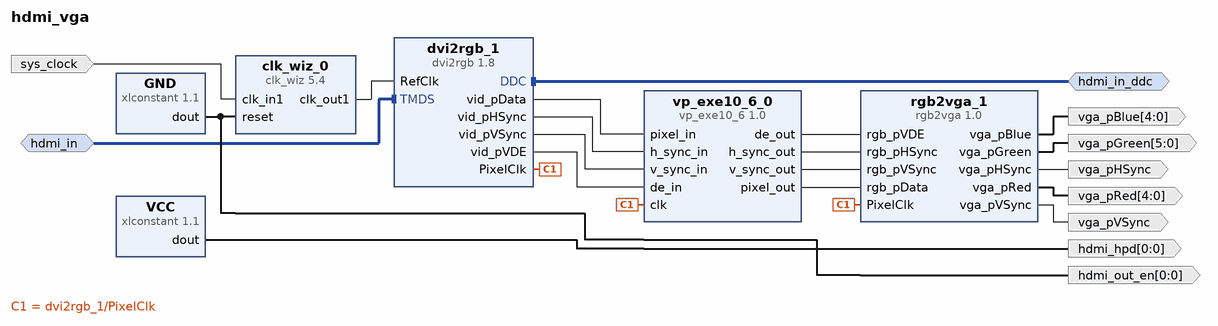
[diagram p0: block diagram of the top level]
# Vivado block design hdmi_vga, xc7z010clg400-1, Vivado 2017.4
create_bd_design hdmi_vga

create_bd_intf_port -mode Master -vlnv xilinx.com:interface:iic_rtl:1.0 hdmi_in_ddc
create_bd_intf_port -mode Slave -vlnv digilentinc.com:interface:tmds_rtl:1.0 hdmi_in
create_bd_port -dir O -from 0 -to 0 hdmi_out_en
create_bd_port -dir O -from 0 -to 0 hdmi_hpd
create_bd_port -dir I -type clk sys_clock
set_property -dict {CONFIG.FREQ_HZ 125000000 CONFIG.CLK_DOMAIN hdmi_vga_sys_clk} [get_bd_ports sys_clock]
create_bd_port -dir O -from 4 -to 0 vga_pRed
create_bd_port -dir O -from 5 -to 0 vga_pGreen
create_bd_port -dir O -from 4 -to 0 vga_pBlue
create_bd_port -dir O vga_pHSync
create_bd_port -dir O vga_pVSync

create_bd_cell -type ip -vlnv xilinx.com:ip:clk_wiz:5.4 clk_wiz_0
set_property -dict [list \
  CONFIG.PRIMITIVE PLL \
  CONFIG.CLKOUT1_REQUESTED_OUT_FREQ 200.000 \
  CONFIG.CLKOUT1_DRIVES BUFG \
  CONFIG.CLKOUT2_DRIVES BUFG \
  CONFIG.CLKOUT3_DRIVES BUFG \
  CONFIG.CLKOUT4_DRIVES BUFG \
  CONFIG.CLKOUT5_DRIVES BUFG \
  CONFIG.CLKOUT6_DRIVES BUFG \
  CONFIG.CLKOUT7_DRIVES BUFG \
  CONFIG.MMCM_DIVCLK_DIVIDE 1 \
  CONFIG.MMCM_CLKFBOUT_MULT_F 8 \
  CONFIG.MMCM_COMPENSATION ZHOLD \
  CONFIG.MMCM_CLKOUT0_DIVIDE_F 5 \
  CONFIG.CLKOUT1_JITTER 109.241 \
  CONFIG.CLKOUT1_PHASE_ERROR 96.948 \
] [get_bd_cells clk_wiz_0]
create_bd_cell -type ip -vlnv xilinx.com:ip:xlconstant:1.1 GND
set_property -dict {CONFIG.CONST_VAL 0} [get_bd_cells GND]
create_bd_cell -type ip -vlnv xilinx.com:ip:xlconstant:1.1 VCC
create_bd_cell -type ip -vlnv digilentinc.com:ip:rgb2vga:1.0 rgb2vga_1
create_bd_cell -type ip -vlnv digilentinc.com:ip:dvi2rgb:1.8 dvi2rgb_1
create_bd_cell -type ip -vlnv xilinx.com:user:vp_exe10_6:1.0 vp_exe10_6_0

# ---- connections ----

connect_bd_intf_net [get_bd_intf_ports hdmi_in_ddc] [get_bd_intf_pins dvi2rgb_1/DDC]
connect_bd_intf_net [get_bd_intf_ports hdmi_in] [get_bd_intf_pins dvi2rgb_1/TMDS]
connect_bd_net [get_bd_pins GND/dout] [get_bd_ports hdmi_out_en] [get_bd_pins clk_wiz_0/reset]
connect_bd_net -net dvi2rgb_0_PixelClk [get_bd_pins dvi2rgb_1/PixelClk] [get_bd_pins rgb2vga_1/PixelClk] [get_bd_pins vp_exe10_6_0/clk]
connect_bd_net [get_bd_pins VCC/dout] [get_bd_ports hdmi_hpd]
connect_bd_net [get_bd_ports sys_clock] [get_bd_pins clk_wiz_0/clk_in1]
connect_bd_net [get_bd_pins rgb2vga_1/vga_pRed] [get_bd_ports vga_pRed]
connect_bd_net [get_bd_pins rgb2vga_1/vga_pGreen] [get_bd_ports vga_pGreen]
connect_bd_net [get_bd_pins rgb2vga_1/vga_pBlue] [get_bd_ports vga_pBlue]
connect_bd_net [get_bd_pins rgb2vga_1/vga_pHSync] [get_bd_ports vga_pHSync]
connect_bd_net [get_bd_pins rgb2vga_1/vga_pVSync] [get_bd_ports vga_pVSync]
connect_bd_net [get_bd_pins clk_wiz_0/clk_out1] [get_bd_pins dvi2rgb_1/RefClk]
connect_bd_net [get_bd_pins dvi2rgb_1/vid_pData] [get_bd_pins vp_exe10_6_0/pixel_in]
connect_bd_net [get_bd_pins dvi2rgb_1/vid_pHSync] [get_bd_pins vp_exe10_6_0/h_sync_in]
connect_bd_net [get_bd_pins dvi2rgb_1/vid_pVSync] [get_bd_pins vp_exe10_6_0/v_sync_in]
connect_bd_net [get_bd_pins dvi2rgb_1/vid_pVDE] [get_bd_pins vp_exe10_6_0/de_in]
connect_bd_net [get_bd_pins vp_exe10_6_0/de_out] [get_bd_pins rgb2vga_1/rgb_pVDE]
connect_bd_net [get_bd_pins vp_exe10_6_0/h_sync_out] [get_bd_pins rgb2vga_1/rgb_pHSync]
connect_bd_net [get_bd_pins vp_exe10_6_0/v_sync_out] [get_bd_pins rgb2vga_1/rgb_pVSync]
connect_bd_net [get_bd_pins vp_exe10_6_0/pixel_out] [get_bd_pins rgb2vga_1/rgb_pData]

validate_bd_design
save_bd_design
